# Altium project SD.PrjPCB
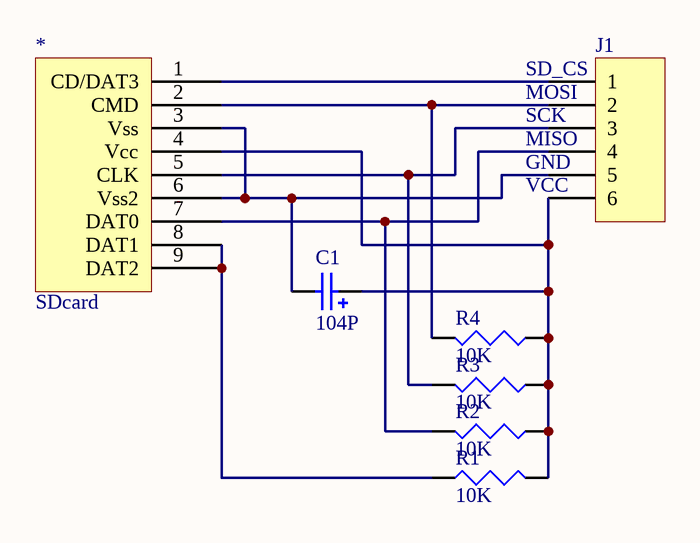
[diagram p0: SD.SchDoc]
1 sheet, 7 parts. Net scope: global (net labels, ports and power ports of the same name join across sheets).
Board file: SD.PcbDoc

## Sheet SD.SchDoc
size A4

### Parts
*  SDcard  [SDcard]
C1  value 104P  [CC2012-0805]  (hidden comment: Cap Pol3)
J1  Header 6  [HDR1X6]  (value not drawn)
R1  value 10K  [R2012-0805]  (hidden comment: Res3)
R2  value 10K  [R2012-0805]  (hidden comment: Res3)
R3  value 10K  [R2012-0805]  (hidden comment: Res3)
R4  value 10K  [R2012-0805]  (hidden comment: Res3)

### Nets
Net*_1: *.1(CD/DAT3) J1.1
Net*_2: *.2(CMD) J1.2 R4.2
Net*_3: *.3(Vss) *.6(Vss2) C1.2 J1.5
Net*_4: *.4(Vcc) C1.1 J1.6 R1.2 R2.1 R3.1 R4.1
Net*_5: *.5(CLK) J1.3 R3.2
Net*_7: *.7(DAT0) J1.4 R2.2
Net*_8: *.8(DAT1) *.9(DAT2) R1.1

### Notes on the sheet
- (near J1) SD_CS
- (near J1) MOSI
- (near J1) SCK
- (near J1) MISO
- (near J1) GND
- (near J1) VCC

### Library data of the parts
C1 = Cap Pol3: Polarized Capacitor (Surface Mount); Published: 8-Jun-2000; Revision: July-2002: Re-released for DXP Platform.; Publisher: Altium Limited
J1 = Header 6: Header, 6-Pin; Revision: 17-Jul-2002: Re-released for DXP Platform.; Publisher: Altium Limited
R1-R4 = Res3: Resistor; Published: 8-Jun-2000; Revision: July-2002: Re-released for DXP Platform.; Publisher: Altium Limited